# EAGLE design USB2PPM (EAGLE 7.7.0)
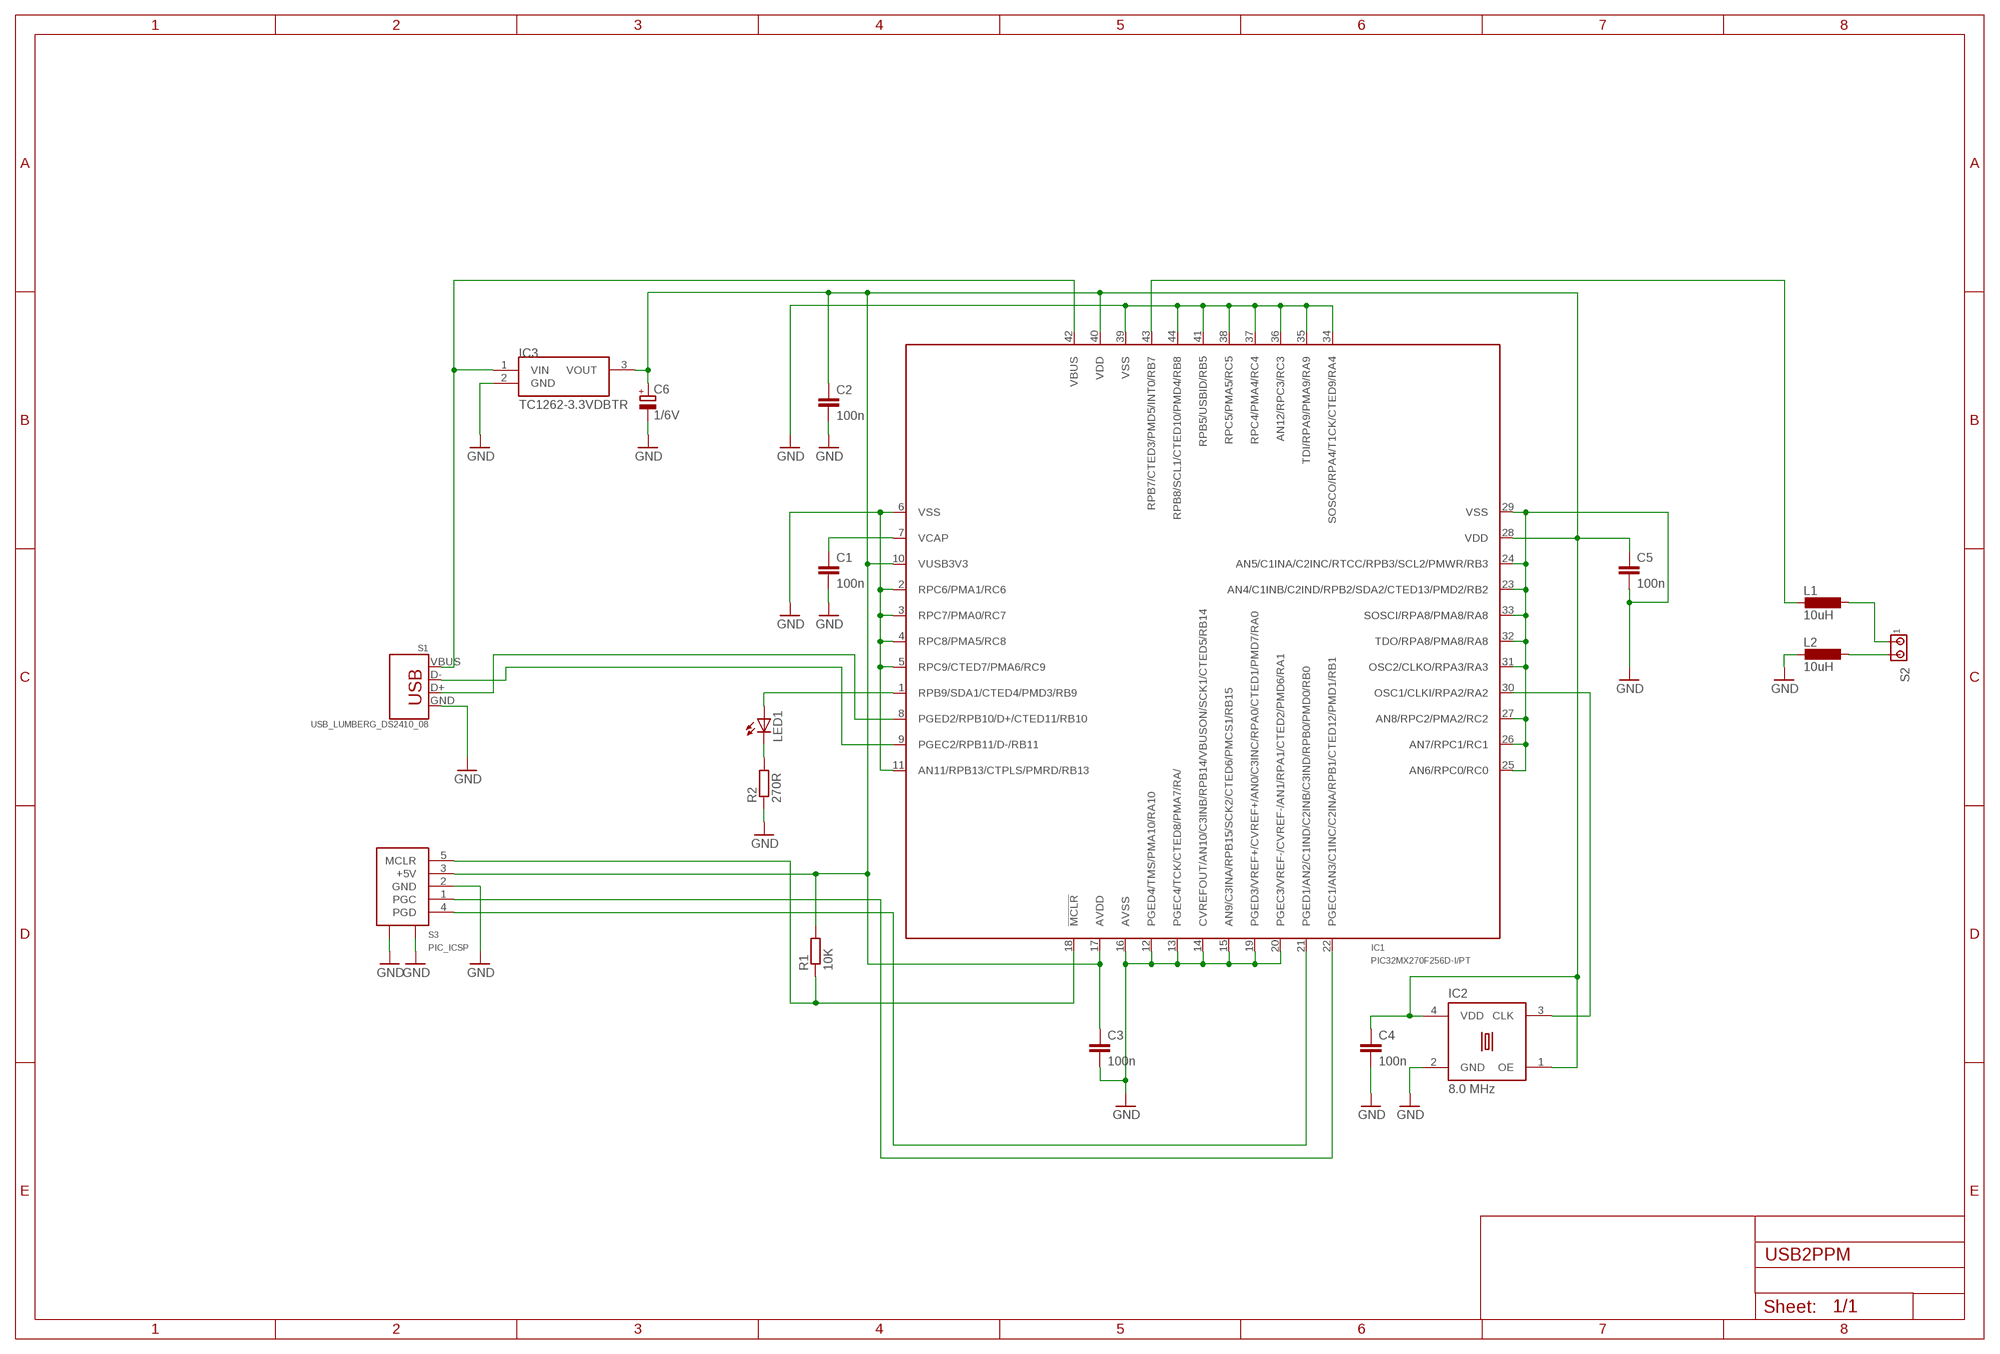
[diagram p0: schematic, sheet 1]

## Parts
C1  100n  C-EUC0805K  [C0805K]
C2  100n  C-EUC0805K  [C0805K]
C3  100n  C-EUC0805K  [C0805K]
C4  100n  C-EUC0805K  [C0805K]
C5  100n  C-EUC0805K  [C0805K]
C6  1/6V  CPOL-EUSMCA  [SMC_A]
IC1  PIC32MX270F256D-I/PT  PIC32MX250F128D-I/PT  [TQFP44]
IC2  8.0 MHz  501_SI3.2X4  [DFN_3.2X5MM(4MM)]
IC3  TC1262-3.3VDBTR  MCP1703  [SOT223]
L1  10uH  L-EUL3225M  [L3225M]
L2  10uH  L-EUL3225M  [L3225M]
LED1  LEDSML0805  [SML0805]
R1  10K  R-EU_R0805W  [R0805W]
R2  270R  R-EU_R0805W  [R0805W]
S1  USB_LUMBERG_DS2410_08  [USB-A-LUMBERG_DS2410_08]
S2  MTA02-100  [10X02MTA]
S3  PIC_ICSP  [53395-05_GND]

## Nets
!MCLR: IC1.18(!MCLR) R1.1 S3.5(MCLR)
+5V_USB: IC1.42(VBUS) IC3.1(VIN) S1.VBUS(GND)
D+: IC1.8(PGED2/RPB10/D+/CTED11/RB10) S1.D+(D-)
D-: IC1.9(PGEC2/RPB11/D-/RB11) S1.D-(D+)
GND: C1.2 C2.2 C3.2 C4.2 C5.2 C6.- IC1.2(RPC6/PMA1/RC6) IC1.3(RPC7/PMA0/RC7) IC1.4(RPC8/PMA5/RC8) IC1.5(RPC9/CTED7/PMA6/RC9) IC1.6(VSS) IC1.11(AN11/RPB13/CTPLS/PMRD/RB13) IC1.12(PGED4/TMS/PMA10/RA10) IC1.13(PGEC4/TCK/CTED8/PMA7/RA/) IC1.14(CVREFOUT/AN10/C3INB/RPB14/VBUSON/SCK1/CTED5/RB14) IC1.15(AN9/C3INA/RPB15/SCK2/CTED6/PMCS1/RB15) IC1.16(AVSS) IC1.19(PGED3/VREF+/CVREF+/AN0/C3INC/RPA0/CTED1/PMD7/RA0) IC1.20(PGEC3/VREF-/CVREF-/AN1/RPA1/CTED2/PMD6/RA1) IC1.23(AN4/C1INB/C2IND/RPB2/SDA2/CTED13/PMD2/RB2) IC1.24(AN5/C1INA/C2INC/RTCC/RPB3/SCL2/PMWR/RB3) IC1.25(AN6/RPC0/RC0) IC1.26(AN7/RPC1/RC1) IC1.27(AN8/RPC2/PMA2/RC2) IC1.29(VSS) IC1.31(OSC2/CLKO/RPA3/RA3) IC1.32(TDO/RPA8/PMA8/RA8) IC1.33(SOSCI/RPA8/PMA8/RA8) IC1.34(SOSCO/RPA4/T1CK/CTED9/RA4) IC1.35(TDI/RPA9/PMA9/RA9) IC1.36(AN12/RPC3/RC3) IC1.37(RPC4/PMA4/RC4) IC1.38(RPC5/PMA5/RC5) IC1.39(VSS) IC1.41(RPB5/USBID/RB5) IC1.44(RPB8/SCL1/CTED10/PMD4/RB8) IC2.2(GND) IC3.2(GND) L2.2 R2.1 S1.GND(VBUS) S3.2(GND) S3.S1(GND) S3.S2(GND)
LED: IC1.1(RPB9/SDA1/CTED4/PMD3/RB9) LED1.A
N$1: LED1.C R2.2
OSC: IC1.30(OSC1/CLKI/RPA2/RA2) IC2.3(CLK)
PGC: IC1.22(PGEC1/AN3/C1INC/C2INA/RPB1/CTED12/PMD1/RB1) S3.1(PGC)
PGD: IC1.21(PGED1/AN2/C1IND/C2INB/C3IND/RPB0/PMD0/RB0) S3.4(PGD)
PPM: IC1.43(RPB7/CTED3/PMD5/INT0/RB7) L1.2
PPM_GND: L2.1 S2.2
PPM_OUT: L1.1 S2.1
VCAP: C1.1 IC1.7(VCAP)
VDD: C2.1 C3.1 C4.1 C5.1 C6.+ IC1.10(VUSB3V3) IC1.17(AVDD) IC1.28(VDD) IC1.40(VDD) IC2.1(OE) IC2.4(VDD) IC3.3(VOUT) R1.2 S3.3(+5V)

## Library data of the parts
C1-C5 = rcl:C-EU: CAPACITOR, European symbol
C6 = rcl:CPOL-EU: POLARIZED CAPACITOR, European symbol
IC1 = microchip_own:PIC32MX250F128D: PIC32MX250F128D-I/PT 50 MHz, 33I/O(s) ROM 128kB, RAM 32kB, I2C/LIN/SPI/UART/USB Farnell Best.Nr.: 2360352
IC2 = crystals:501_SI: 501 Series Oscillatzor SMD 3V3 farnell: 2394134 RS-Online : 800-8620 Size : 5 (4) x 3.2 mm farnell: 2394136 Size : 3.2 x 2.5 mm 24 MHz
IC3 = vreg:MCP1703: MCP1703 250mA, 16V input, SMD LDO regulators
L1 L2 = rcl:L-EU: INDUCTOR, European symbol
LED1 = led:LED: LED OSRAM: - CHIPLED LG R971, LG N971, LY N971, LG Q971, LY Q971, LO R971, LY R971 LH N974, LH R974 LS Q976, LO Q976, LY Q976 LO Q996 - Hyper CHIPLED LW Q18S LB Q993, LB Q99A, LB R99A - SideLED LS A670, LO A670, LY A670, LG A670, LP A670 LB A673, LV A673, LT A673, LW A673 LH A674 LY A675 LS A676, LA A676, LO A676, LY A676, LW A676 LS A679, LY A679, LG A679 - Hyper Micro SIDELED® LS Y876, LA Y876, LO Y876, LY Y876 LT Y87S - SmartLED LW L88C, LW L88S LB L89C, LB L89S, LG L890 LS L89K, LO L89K, LY L89K LS L896, LA L896, LO L896, LY L896 - TOPLED LS T670, LO T670, LY T670, LG T670, LP T670 LSG T670, LSP T670, LSY T670, LOP T670, LYG T670 LG T671, LOG T671, LSG T671 LB T673, LV T673, LT T673, LW T673 LH T674 LS T676, LA T676, LO T676, LY T676, LB T676, LH T676, LSB T676, LW T676 LB T67C, LV T67C, LT T67C, LS T67K, LO T67K, LY T67K, LW E67C LS E67B, LA E67B, LO E67B, LY E67B, LB E67C, LV E67C, LT E67C LW T67C LS T679, LY T679, LG T679 LS T770, LO T770, LY T770, LG T770, LP T770 LB T773, LV T773, LT T773, LW T773 LH T774 LS E675, LA E675, LY E675, LS T675 LS T776, LA T776, LO T776, LY T776, LB T776 LHGB T686 LT T68C, LB T68C - Hyper Mini TOPLED® LB M676 - Mini TOPLED Santana® LG M470 LS M47K, LO M47K, LY M47K Source: http://www.osram.convergy.de LUXEON: - LUMILED® LXK2-PW12-R00, LXK2-PW12-S00, LXK2-PW14-U00, LXK2-PW14-V00 LXK2-PM12-R00, LXK2-PM12-S00, LXK2-PM14-U00 LXK2-PE12-Q00, LXK2-PE12-R00, LXK2-PE12-S00, LXK2-PE14-T00, LXK2-PE14-U00 LXK2-PB12-K00, LXK2-PB12-L00, LXK2-PB12-M00, LXK2-PB14-N00, LXK2-PB14-P00, LXK2-PB14-Q00 LXK2-PR12-L00, LXK2-PR12-M00, LXK2-PR14-Q00, LXK2-PR14-R00 LXK2-PD12-Q00, LXK2-PD12-R00, LXK2-PD12-S00 LXK2-PH12-R00, LXK2-PH12-S00 LXK2-PL12-P00, LXK2-PL12-Q00, LXK2-PL12-R00 Source: www.luxeon.com KINGBRIGHT: KA-3528ASYC Source: www.kingbright.com
R1 R2 = rcl:R-EU_: RESISTOR, European symbol
S1 = connector:USB_LUMBERG_DS2410_08
S2 = con-amp:MTA02-100: AMP connector
S3 = connector:PIC_ICSP*

## Board
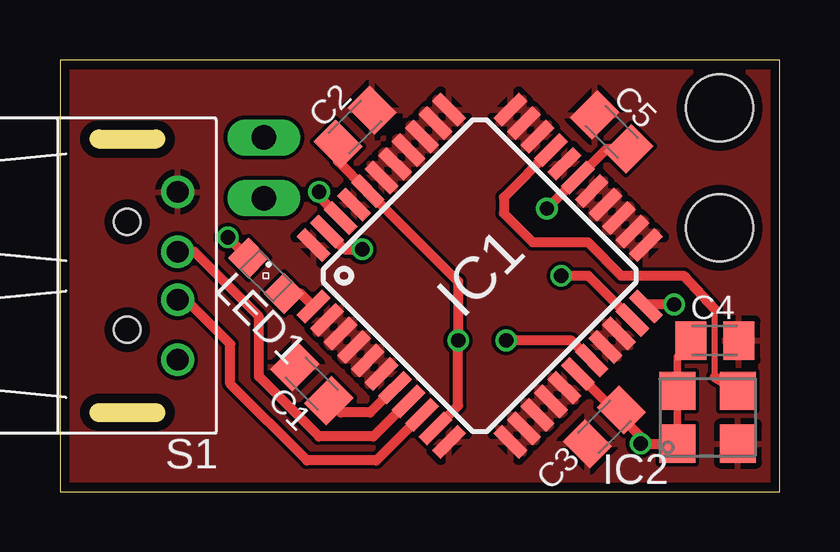
[diagram p1: board, top side]
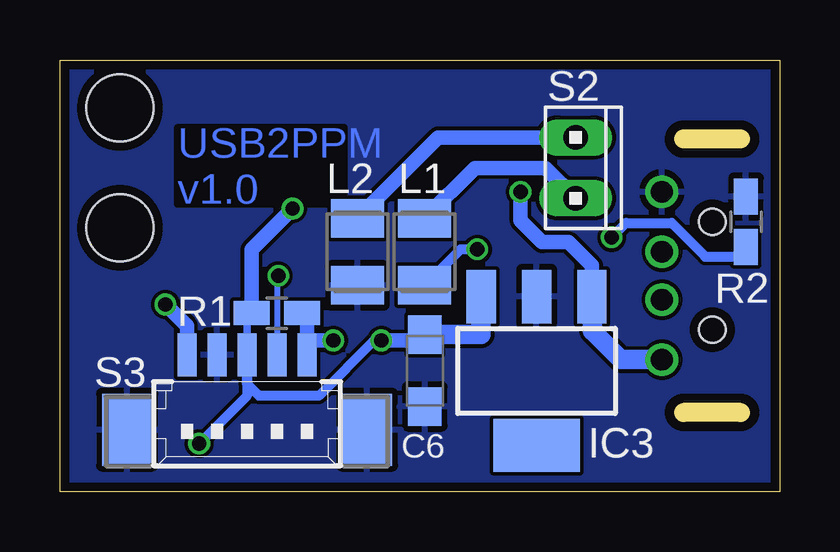
[diagram p2: board, bottom side, seen from below]

Size 30 x 18 mm. Coordinates in mm from the lower left corner, seen from the top.
Outline: 0,0 30,0 30,18 0,18 0,0
Copper layers (1*16): Top 0.035559375mm / dielectric 1.6mm / Bottom 0.035559375mm
Design rules "oshpark-2layer *": minimum track width 6mil, minimum drill 10mil, track to track 6mil, track to pad 6mil, pad to pad 6mil, via to via 6mil, smd to smd 6mil, copper to edge 15mil, drill to drill 6mil, minimum pad ring 5mil, minimum via ring 5mil, stop-mask expansion 0mil, vias tented up to drill 30mil, thermal gap 10mil
Holes 2.8 mm at 27.5,16 27.5,11

### Footprints (pad centres in the part's own frame; a part is rotated, then mirrored left to right if it is on the bottom)
C0805K = smd 1.3 x 1.6: 1 -1,0; 2 1,0
SMC_A = smd 1.6 x 1.4: + -1.5,0; - 1.5,0
TQFP44 = smd 1.5 x 0.5: 1 -5.8,4; 2 -5.8,3.2; 3 -5.8,2.4; 4 -5.8,1.6; 5 -5.8,0.8; 6 -5.8,0; 7 -5.8,-0.8; 8 -5.8,-1.6; 9 -5.8,-2.4; 10 -5.8,-3.2; 11 -5.8,-4; 23 5.8,-4; 24 5.8,-3.2; 25 5.8,-2.4; 26 5.8,-1.6; 27 5.8,-0.8; 28 5.8,0; 29 5.8,0.8; 30 5.8,1.6; 31 5.8,2.4; 32 5.8,3.2; 33 5.8,4 | smd 0.5 x 1.5: 12 -4,-5.8; 13 -3.2,-5.8; 14 -2.4,-5.8; 15 -1.6,-5.8; 16 -0.8,-5.8; 17 0,-5.8; 18 0.8,-5.8; 19 1.6,-5.8; 20 2.4,-5.8; 21 3.2,-5.8; 22 4,-5.8; 34 4,5.8; 35 3.2,5.8; 36 2.4,5.8; 37 1.6,5.8; 38 0.8,5.8; 39 0,5.8; 40 -0.8,5.8; 41 -1.6,5.8; 42 -2.4,5.8; 43 -3.2,5.8; 44 -4,5.8
DFN_3.2X5MM(4MM) = smd 1.5 x 1.6: 1 -1.27,-1.1; 2 1.27,-1.1; 3 1.27,1.1; 4 -1.27,1.1
SOT223 = smd 1.219 x 2.235: 1 -2.311,-3.099; 2 0,-3.099; 3 2.311,-3.099 | smd 3.6 x 2.2: 4 0,3.099
L3225M = smd 1.6 x 2.2: 1 -1.4,0; 2 1.4,0
SML0805 = smd 1.2 x 1.2: A 1.05,0; C -1.05,0
R0805W = smd 1.5 x 1: 1 -1.052,0; 2 1.052,0
USB-A-LUMBERG_DS2410_08 = drill 0.914: D+ 2.1,1; D- 2.1,-1; GND 2.1,3.5; VBUS 2.1,-3.5 | hole 1.1: 0,2.25; 0,-2.25
10X02MTA = drill 1.016 long: 1 1.27,0; 2 -1.27,0
53395-05_GND = smd 0.8 x 1.8: 1 2.5,-2.5; 2 1.25,-2.5; 3 0,-2.5; 4 -1.25,-2.5; 5 -2.5,-2.5 | smd 2.1 x 3: S1 5,0.625; S2 -5,0.625

### Placement (x,y rotation side)
C1  10.5,4.5 135 top
C2  12.3,15.2 45 top
C3  22.7,2.7 225 top
C4  27.3,6.3 0 top
C5  23,15 135 top
C6  14.79,5.05 270 bottom
IC1  17.5,9 45 top
IC2  27,3.1 0 top
IC3  10.13,5.03 180 bottom
L1  14.8,10 270 bottom
L2  17.6,10 270 bottom
LED1  8.6,9 315 top
R1  20.96,7.44 180 bottom
R2  1.4,11.25 270 bottom
S1  2.8,9 0 top
S2  8.5,13.5 270 bottom
S3  22.2,3.2 180 bottom

### Tracks (layer width: path | path; a pad name or v marks a point on that pad's centre or on a via)
!MCLR  (via drill 0.6)
  Top 0.406: IC1.18 21.33,6.3 v18.6,6.3
  Bottom 0.254: 19.7,6.3 S3.5
  Bottom 0.305: 19.7,7.33 R1.1
  Bottom 0.61: S3.5 19.7,7.33 | v18.6,6.3 19.7,6.3
+5V_USB  (via drill 0.6)
  Top 0.406: v10.8,12.5 10.8,12.31 IC1.42
  Bottom 0.305: S1.VBUS
  Bottom 0.61: IC3.1 7.82,9.42 8.8,10.4 9.9,10.4 10.8,11.3 v10.8,12.5
  Bottom 0.813: IC3.1 7.8,8.11 7.8,6.7 6.61,5.51 S1.VBUS
D+
  Top 0.406: IC1.8 13.06,2.3 10.8,2.3 8.3,4.8 8.3,7.3 5.6,10 S1.D+
D-
  Top 0.406: IC1.9 13.19,1.3 10.3,1.3 7.1,4.5 7.1,6.15 5.25,8 S1.D-
GND
  pour Top: 0,0 0,18 30,18 30,0
  pour Bottom: 0,0 0,18 30,18 30,0
LED
  Top 0.406: IC1.1 10.04,8.26 LED1.A
N$1  (via drill 0.6)
  Top 0.406: LED1.C | LED1.C v7,10.6
  Bottom 0.406: v7,10.6 6.4,11.2 4.5,11.2 3.1,9.8 1.7,9.8 R2.2
OSC
  Top 0.254: 27.3,4.77 27.3,7.6
  Top 0.406: IC2.3 27.3,4.77 | IC1.30 18.5,12.26 18.5,11.6 19.7,10.4 22,10.4 23.4,9 26,9 27.3,7.6
PGC  (via drill 0.6)
  Top 0.305: 24.43,7.8 IC1.22
  Top 0.406: v25.6,7.8 24.43,7.8
  Bottom 0.61: S3.1 24.7,6.9 v25.6,7.8
PGD  (via drill 0.6)
  Top 0.406: IC1.21 22.02,9 v20.9,9
  Bottom 0.254: v20.9,9 20.95,8.95 S3.4
PPM  (via drill 0.6)
  Top 0.406: IC1.43 11.88,10.1 v12.6,10.1
  Bottom 0.406: v12.6,10.1 13.3,10.1 L1.2
PPM_GND
  Bottom 0.61: S2.2 14.23,14.77 L2.1
PPM_OUT
  Bottom 0.61: S2.1 9.77,13.5 12.7,13.5 L1.1
VCAP
  Top 0.406: IC1.7 12.93,3.3 11.7,3.3 C1.1
VDD  (via drill 0.6)
  Top 0.254: 11.71,14.3 C2.1
  Top 0.305: IC2.1 IC2.4 25.73,5.63 C4.1 | 22.89,3.61 C3.1
  Top 0.406: C2.1 11.59,13.78 IC1.40 16.6,8.77 v16.6,6.3 16.6,3.58 IC1.10 | IC2.1 v24.2,2 24.2,2.3 23,3.5 22.89,3.61 IC1.17 | C5.1 22.79,14.29 IC1.28 v20.3,11.8
  Bottom 0.254: 22,7.45 R1.2
  Bottom 0.305: R1.2 22.2,7.15 S3.3
  Bottom 0.406: v16.6,6.3 16.9,6.3 19.2,4 21.7,4 22.2,4.5 S3.3 22.2,4 v24.2,2
  Bottom 0.61: v16.6,6.3 14.79,6.3 C6.+ | R1.2 22.01,10.09 v20.3,11.8
  Bottom 0.813: C6.+ 12.44,6.55 IC3.3

### Text on the board
Bottom: USB2PPM / v1.0